# Altium schematic sheet Power_Board_Schematic.SchDoc
size A; SheetNumber: 1; SheetTotal: 2
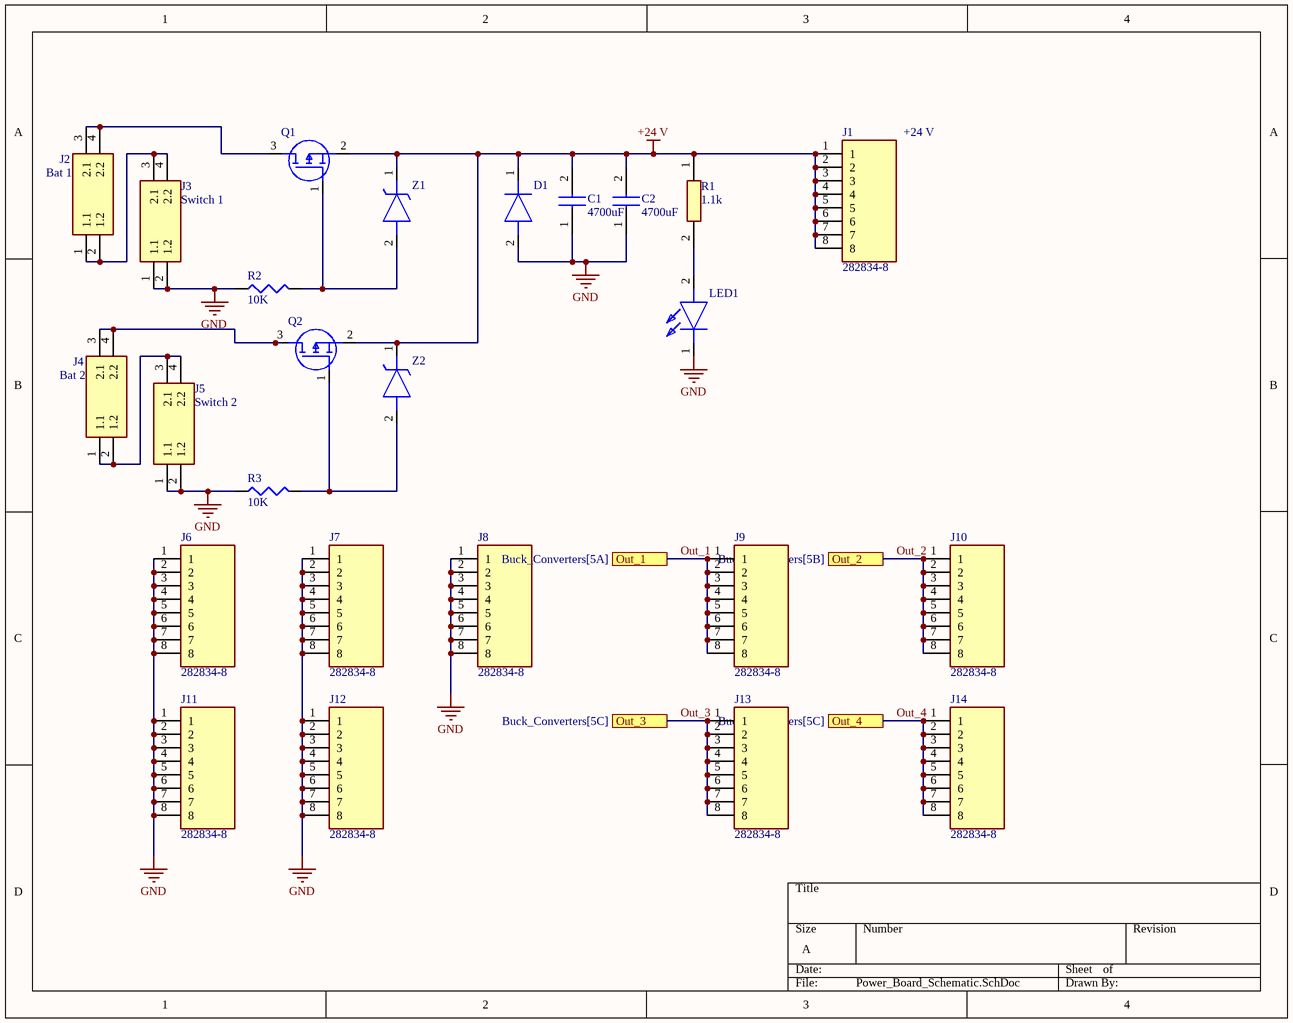
[diagram p0: Power_Board_Schematic.SchDoc]

## Parts
C1  4700uF  [CAPPRD1000W80D2200H4100]
C2  4700uF  [CAPPRD1000W80D2200H4100]
D1  SZ1.5SMC36AT3G  [DIOM7958X256N]  (value not drawn)
J1  282834-8  [2828348]
J2  Bat 1  [42820-2XXY_1]
J3  Switch 1  [42820-2XXY_1]
J4  Bat 2  [42820-2XXY_1]
J5  Switch 2  [42820-2XXY_1]
J6  282834-8  [2828348]
J7  282834-8  [2828348]
J8  282834-8  [2828348]
J9  282834-8  [2828348]
J10  282834-8  [2828348]
J11  282834-8  [2828348]
J12  282834-8  [2828348]
J13  282834-8  [2828348]
J14  282834-8  [2828348]
LED1  CMD15-21VYC_TR8  [LEDC3215X130N]  (value not drawn)
Q1  FQB47P06TM-AM002  [FFSB0865BF085]  (value not drawn)
Q2  FQB47P06TM-AM002  [FFSB0865BF085]  (value not drawn)
R1  1.1k  [RESC5025X71N]
R2  10K  [1206]
R3  10K  [1206]
Z1  SZ1SMB5925BT3G  [DIOM5436X247N]  (value not drawn)
Z2  SZ1SMB5925BT3G  [DIOM5436X247N]  (value not drawn)

## Ports
Out_1 (see Buck_Converters[5A]), Out_2 (see Buck_Converters[5B]), Out_3 (see Buck_Converters[5C]), Out_4 (see Buck_Converters[5C])

## Nets
+24 V: C1.2(-) C2.2(-) D1.1(K) J1.1 J1.2 J1.3 J1.4 J1.5 J1.6 J1.7 J1.8 Q1.2(S) Q2.2(S) R1.1 Z1.1(K) Z2.1(K)
GND: C1.1(+) C2.1(+) D1.2(A) J3.1(1.1) J3.2(1.2) J5.1(1.1) J5.2(1.2) J6.1 J6.2 J6.3 J6.4 J6.5 J6.6 J6.7 J6.8 J7.1 J7.2 J7.3 J7.4 J7.5 J7.6 J7.7 J7.8 J8.1 J8.2 J8.3 J8.4 J8.5 J8.6 J8.7 J8.8 J11.1 J11.2 J11.3 J11.4 J11.5 J11.6 J11.7 J11.8 J12.1 J12.2 J12.3 J12.4 J12.5 J12.6 J12.7 J12.8 LED1.1(K) R2.1 R3.1
Out_1: J9.1 J9.2 J9.3 J9.4 J9.5 J9.6 J9.7 J9.8 ; port Out_1
Out_2: J10.1 J10.2 J10.3 J10.4 J10.5 J10.6 J10.7 J10.8 ; port Out_2
Out_3: J13.1 J13.2 J13.3 J13.4 J13.5 J13.6 J13.7 J13.8 ; port Out_3
Out_4: J14.1 J14.2 J14.3 J14.4 J14.5 J14.6 J14.7 J14.8 ; port Out_4
NetJ2_1: J2.1(1.1) J2.2(1.2) J3.3(2.1) J3.4(2.2)
NetJ2_3: J2.3(2.1) J2.4(2.2) Q1.3(D)
NetJ4_1: J4.1(1.1) J4.2(1.2) J5.3(2.1) J5.4(2.2)
NetJ4_3: J4.3(2.1) J4.4(2.2) Q2.3(D)
NetLED1_2: LED1.2(A) R1.2
NetQ1_1: Q1.1(G) R2.2 Z1.2(A)
NetQ2_1: Q2.1(G) R3.2 Z2.2(A)

## Notes on the sheet
- +24 V

## Library data of the parts
C1 C2 = 860010683032: Capacitor; Manufacturer_Name: Wurth Elektronik; Datasheet Link: https://componentsearchengine.com/Datasheets/2/860010683032.pdf; Height: 41mm; Manufacturer_Part_Number: 860010683032; Mouser Part Number: 710-860010683032; Mouser Price/Stock: https://www.mouser.co.uk/ProductDetail/Wurth-Elektronik/860010683032?qs=0KOYDY2FL2%252Biyra9tgGF6Q%3D%3D
D1 = SZ1.5SMC36AT3G: Diode; Manufacturer_Name: LITTELFUSE; Datasheet Link: https://ru.mouser.com/datasheet/2/240/Littelfuse_TVS_Diode_SZ1_5SMCxxA_Datasheet.pdf-1317300.pdf; Height: 2.56mm; Manufacturer_Part_Number: SZ1.5SMC36AT3G; Mouser Part Number: 863-SZ1.5SMC36AT3G; Mouser Price/Stock: https://www.mouser.co.uk/ProductDetail/Littelfuse/SZ1.5SMC36AT3G?qs=sK5eIuwOod6Y2gxgy5q9QA%3D%3D
J1 J6-J14 = 282834-8: Connector; Manufacturer_Name: TE Connectivity; Datasheet Link: https://www.te.com/commerce/DocumentDelivery/DDEController?Action=showdoc&DocId=Customer+Drawing%7F282834%7FC1%7Fpdf%7FEnglish%7FENG_CD_282834_C1.pdf%7F282834-9; Height: 10.3mm; Manufacturer_Part_Number: 282834-8; Mouser Part Number: 571-282834-8; Mouser Price/Stock: https://www.mouser.co.uk/ProductDetail/TE-Connectivity/282834-8?qs=A%252Bip%252BNCYi6OmCuLnrGmJlA%3D%3D; Arrow Part Number: 282834-8; Arrow Price/Stock: https://www.arrow.com/en/products/282834-8/te-connectivity?region=nac
J2-J5 = 42820-2214: Connector; Manufacturer_Name: Molex; Datasheet Link: https://www.molex.com/pdm_docs/sd/428204224_sd.pdf; Height: 14.1mm; Manufacturer_Part_Number: 42820-2214; Mouser Part Number: 538-42820-2214; Mouser Price/Stock: https://www.mouser.co.uk/ProductDetail/Molex/42820-2214?qs=c8NFF48pVsDmrlzUGa%2Fydg%3D%3D
LED1 = CMD15-21VYC_TR8: LED; Manufacturer_Name: Visual Communications Company; Manufacturer_Part_Number: CMD15-21VYC/TR8; Datasheet Link: http://www.farnell.com/datasheets/2059686.pdf?_ga=1.173230763.922535262.1491543497; Height: 1.3mm; Mouser Part Number: 606-CMD15-21VYC; Mouser Price/Stock: https://www.mouser.com/Search/Refine.aspx?Keyword=606-CMD15-21VYC; Arrow Part Number: CMD15-21VYC/TR8; Arrow Price/Stock: https://www.arrow.com/en/products/cmd15-21vyctr8/visual-communications
Q1 Q2 = FQB47P06TM-AM002: MOSFET (P-Channel); Manufacturer_Name: onsemi; Datasheet Link: https://www.onsemi.com/pub/Collateral/FQB47P06-D.PDF; Manufacturer_Part_Number: FQB47P06TM-AM002; Mouser Part Number: 512-FQB47P06TM_AM002; Mouser Price/Stock: https://www.mouser.co.uk/ProductDetail/ON-Semiconductor-Fairchild/FQB47P06TM-AM002?qs=0lQeLiL1qyZm9vEILtA4gw%3D%3D; Arrow Part Number: FQB47P06TM-AM002; Arrow Price/Stock: https://www.arrow.com/en/products/fqb47p06tm-am002/on-semiconductor?region=nac
R1 = CRCW20101K10FKEF: SMD 3/4watt 1.1Kohms 1% 100ppm; Manufacturer_Name: Vishay; Manufacturer_Part_Number: CRCW20101K10FKEF
R2 R3 = ERJ-P08J183V: Res Thick Film 1206 18K Ohm 5% 1/3W ±200ppm/°C Molded SMD SMD Punched Carrier T/R; Manufacturer: Panasonic; Value: 18kR; Power Rating: 660mW; Voltage Rating: 500V; Max Power Dissipation: 333mW; Voltage Rating (DC): 200V; Supplier 1: Arrow Electronics; Manufacturer Part Number: ERJ-P08J183V; RoHS: Yes; Category: Chip SMD Resistors; Stock 1: 3580; Pricing 1: 1=0.14350, 10=0.11750, 25=0.11650, 100=0.04920, 250=0.04770, 500=0.04720, 1000=0.02830, 3000=0.01870 (USD); Mounting Technology: Surface Mount; Case/Package: 1206; Case Code (Imperial): 1206; Case Code (Metric): 3216; Contact Plating: Tin; Min Operating Temperature: -55°C; Max Operating Temperature: 155°C; Tolerance: 5%; Packaging: Tape and Reel; Package Quantity: 5000; Termination: SMD/SMT; Resistor Type: Thick Film; Number of Terminations: 2; Temperature Coefficient: 200ppm/°C; Series: ERJ; Length: 0.126inch; Width: 1.6mm; Height: 0.028inch; Radiation Hardening: No; Lead Free: Contains Lead; RoHS Compliant: Yes; ComponentLink1URL: http://www.mouser.com/ds/2/315/AOA0000CE4-64075.pdf?src-supplier=Mouser; ComponentLink1Description: http://www.mouser.com/ds/2/315/AOA0000CE4-64075.pdf?src-supplier=Mouser; ComponentLink2URL: http://www.onlinecomponents.com/datasheet/erj-p08j183v.aspx?p=44454764&src-supplier=Onlinecomponents.com; ComponentLink2Description: http://www.onlinecomponents.com/datasheet/erj-p08j183v.aspx?p=44454764&src-supplier=Onlinecomponents.com; ComponentLink3URL: http://industrial.panasonic.com/www-data/pdf/AOA0000/AOA0000CE4.pdf?src-supplier=Avnet; ComponentLink3Description: http://industrial.panasonic.com/www-data/pdf/AOA0000/AOA0000CE4.pdf?src-supplier=Avnet; ComponentLink4URL: https://industrial.panasonic.com/cdbs/www-data/pdf/RDO0000/AOA0000C331.pdf?src-supplier=Digi-Key; ComponentLink4Description: https://industrial.panasonic.com/cdbs/www-data/pdf/RDO0000/AOA0000C331.pdf?src-supplier=Digi-Key; Supplier Part Number 1: ERJ-P08J183V
Z1 Z2 = SZ1SMB5925BT3G: Zener Diode; Manufacturer_Name: onsemi; Datasheet Link: http://www.onsemi.com/pub/Collateral/1SMB5913BT3-D.PDF; Height: 2.47mm; Manufacturer_Part_Number: SZ1SMB5925BT3G; Mouser Part Number: 863-SZ1SMB5925BT3G; Mouser Price/Stock: https://www.mouser.co.uk/ProductDetail/ON-Semiconductor/SZ1SMB5925BT3G?qs=PJJcWtbOkNWGzKmay6pYIA%3D%3D; Arrow Part Number: SZ1SMB5925BT3G; Arrow Price/Stock: https://www.arrow.com/en/products/sz1smb5925bt3g/on-semiconductor